# Altium schematic sheet Block Diyagrami.SchDoc: Wireless Security Detector
size A3; ApprovedBy: Berke Tırpan; SheetNumber: 2; SheetTotal: 2; ENG_APP_DATE: --/--/--; DSN_APP_DATE: --/--/--; CHK_APP_DATE: --/--/--
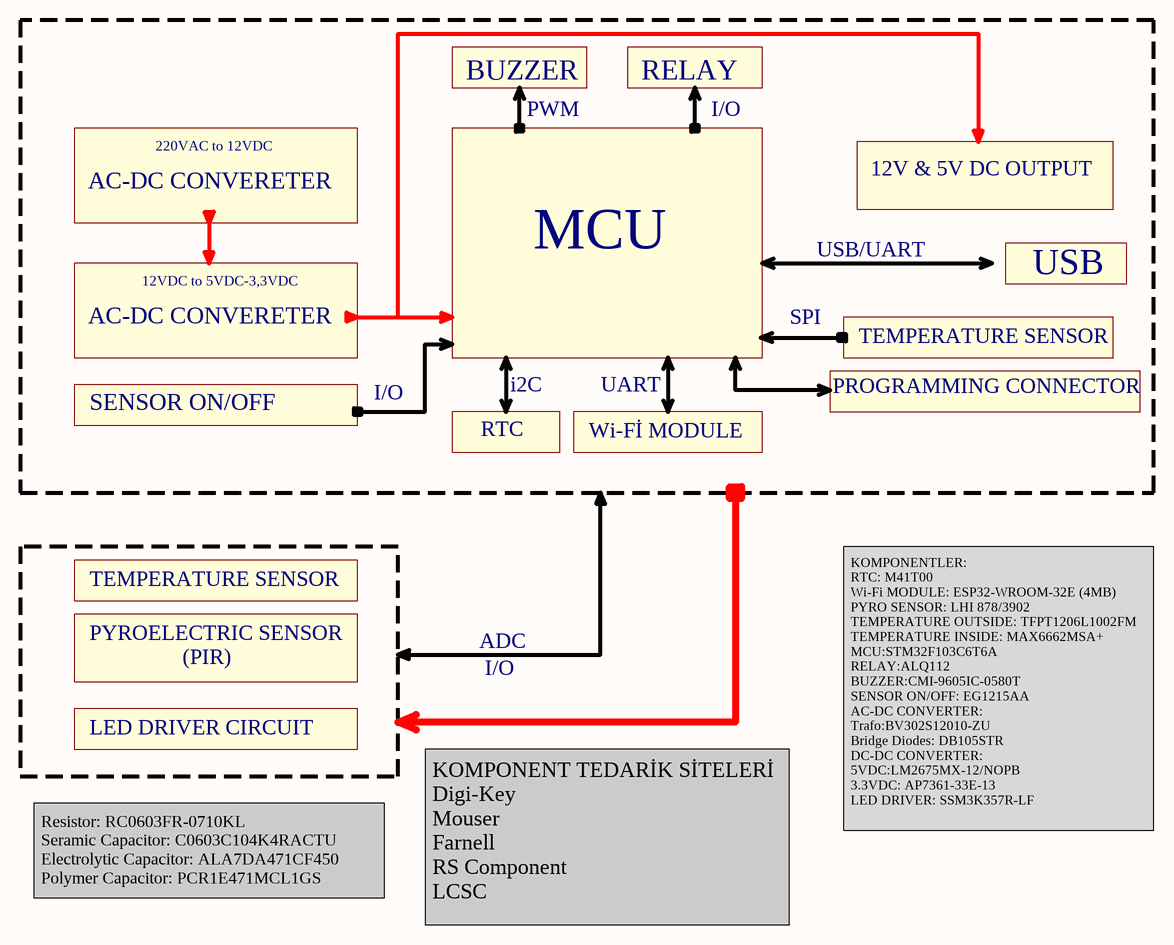
[diagram p0: Block Diyagrami.SchDoc]

## Notes on the sheet
- BUZZER
- RELAY
- 220VAC to 12VDC
- PWM
- I/O
- AC-DC CONVERETER
- 12V & 5V DC OUTPUT
- 12VDC to 5VDC-3,3VDC
- MCU
- USB/UART
- USB
- SPI
- TEMPERATURE SENSOR
- SENSOR ON/OFF
- RTC
- i2C
- Wi-Fİ MODULE
- UART
- PROGRAMMING CONNECTOR
- PYROELECTRIC SENSOR
- (PIR)
- ADC
- LED DRIVER CIRCUIT
- KOMPONENTLER:
  RTC: M41T00
  Wi-Fi MODULE: ESP32-WROOM-32E (4MB)
  PYRO SENSOR: LHI 878/3902
  TEMPERATURE OUTSIDE: TFPT1206L1002FM
  TEMPERATURE INSIDE: MAX6662MSA+
  MCU:STM32F103C6T6A
  RELAY:ALQ112
  BUZZER:CMI-9605IC-0580T
  SENSOR ON/OFF: EG1215AA
  AC-DC CONVERTER:
  Trafo:BV302S12010-ZU
  Bridge Diodes: DB105STR
  DC-DC CONVERTER:
  5VDC:LM2675MX-12/NOPB
  3.3VDC: AP7361-33E-13
  LED DRIVER: SSM3K357R-LF
- Resistor: RC0603FR-0710KL
  Seramic Capacitor: C0603C104K4RACTU
  Electrolytic Capacitor: ALA7DA471CF450
  Polymer Capacitor: PCR1E471MCL1GS
- KOMPONENT TEDARİK SİTELERİ
  Digi-Key
  Mouser
  Farnell
  RS Component
  LCSC